# Altium schematic sheet Принципиальная схема.SchDoc: =title_line_1 + title_line_2
size 840 x 594 mm; SheetNumber: n
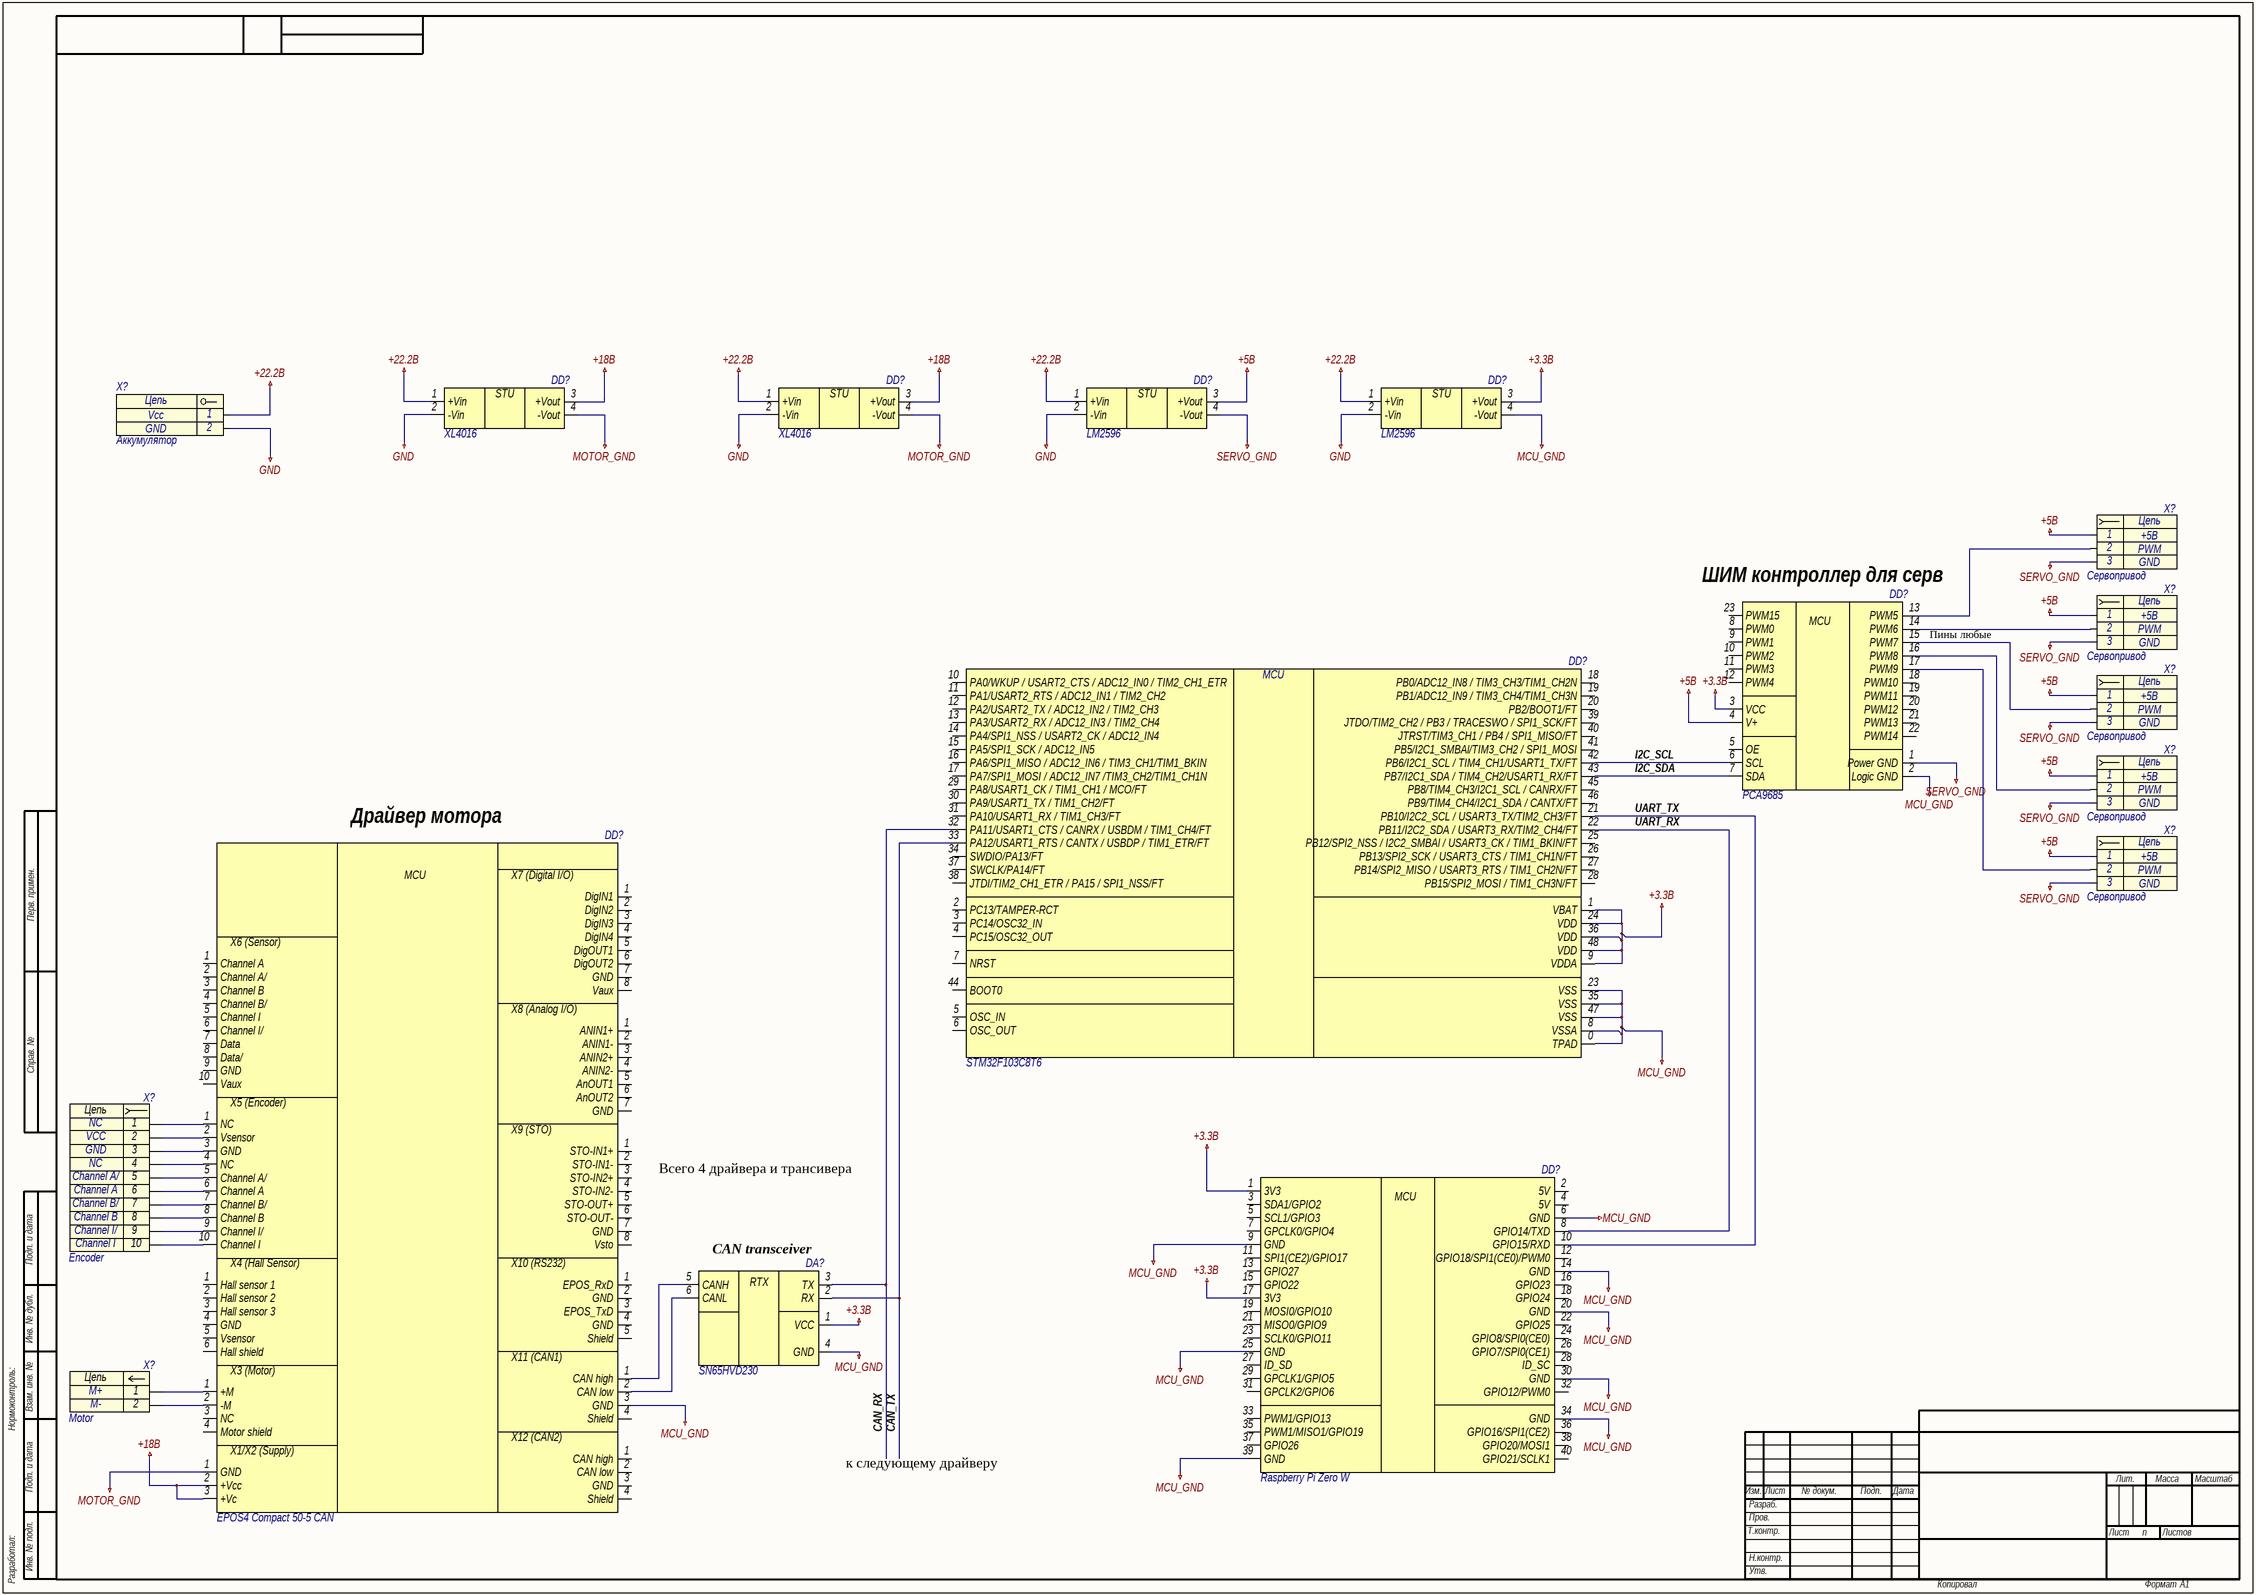
[diagram p0: Принципиальная схема.SchDoc]

## Parts
(Parts that share a designator on the sheet are numbered #1, #2 ... from top to bottom, then left to right.)
DA?  SN65HVD230
DD?#1  XL4016
DD?#2  XL4016
DD?#3  LM2596
DD?#4  LM2596
DD?#5  STM32F103C8T6  [ufqfpn-48_700x700x60p]
DD?#6  PCA9685
DD?#7  Raspberry Pi Zero W
DD?#8  EPOS4 Compact 50-5 CAN
X?#1  Аккумулятор  [terminal-2,54-2-tht-ra-850]
X?#2  Сервопривод  [click-mate-1,25-3-smd-v]
X?#3  Сервопривод  [click-mate-1,25-3-smd-v]
X?#4  Сервопривод  [click-mate-1,25-3-smd-v]
X?#5  Сервопривод  [click-mate-1,25-3-smd-v]
X?#6  Сервопривод  [click-mate-1,25-3-smd-v]
X?#7  Encoder
X?#8  Motor  [DS1029-2-MRW6XB]

## Nets
+3.3В: DA?.1(VCC) DD?#4.3(+Vout) DD?#5.1(VBAT) DD?#5.9(VDDA) DD?#5.24(VDD) DD?#5.36(VDD) DD?#5.48(VDD) DD?#6.3(VCC) DD?#7.1(3V3) DD?#7.17(3V3)
+5В: DD?#3.3(+Vout) DD?#6.4(V+) X?#2.1 X?#3.1 X?#4.1 X?#5.1 X?#6.1
+18В: DD?#1.3(+Vout) DD?#2.3(+Vout) DD?#8.2(+Vcc) DD?#8.3(+Vc)
+22.2В: DD?#1.1(+Vin) DD?#2.1(+Vin) DD?#3.1(+Vin) DD?#4.1(+Vin) X?#1.1
GND: DD?#1.2(-Vin) DD?#2.2(-Vin) DD?#3.2(-Vin) DD?#4.2(-Vin) X?#1.2
MCU_GND: DA?.4(GND) DD?#4.4(-Vout) DD?#5.0(TPAD) DD?#5.8(VSSA) DD?#5.23(VSS) DD?#5.35(VSS) DD?#5.47(VSS) DD?#6.2(Logic_GND) DD?#7.6(GND) DD?#7.9(GND) DD?#7.14(GND) DD?#7.20(GND) DD?#7.25(GND) DD?#7.30(GND) DD?#7.34(GND) DD?#7.39(GND) DD?#8.3(GND)
MOTOR_GND: DD?#1.4(-Vout) DD?#2.4(-Vout) DD?#8.1(GND)
SERVO_GND: DD?#3.4(-Vout) DD?#6.1(Power_GND) X?#2.3 X?#3.3 X?#4.3 X?#5.3 X?#6.3
NetDA?_2: DA?.2(RX) DD?#5.33(PA12/USART1_RTS_/_CANTX_/_USBDP_/_TIM1_ETR/FT)
NetDA?_3: DA?.3(TX) DD?#5.32(PA11/USART1_CTS_/_CANRX_/_USBDM_/_TIM1_CH4/FT)
NetDA?_5: DA?.5(CANH) DD?#8.1(CAN_high)
NetDA?_6: DA?.6(CANL) DD?#8.2(CAN_low)
NetDD?#5_21: DD?#5.21(PB10/I2C2_SCL_/_USART3_TX/TIM2_CH3/FT) DD?#7.10(GPIO15/RXD)
NetDD?#5_22: DD?#5.22(PB11/I2C2_SDA_/_USART3_RX/TIM2_CH4/FT) DD?#7.8(GPIO14/TXD)
NetDD?#5_42: DD?#5.42(PB6/I2C1_SCL_/_TIM4_CH1/USART1_TX/FT) DD?#6.6(SCL)
NetDD?#5_43: DD?#5.43(PB7/I2C1_SDA_/_TIM4_CH2/USART1_RX/FT) DD?#6.7(SDA)
NetDD?#6_13: DD?#6.13(PWM5) X?#2.2
NetDD?#6_14: DD?#6.14(PWM6) X?#3.2
NetDD?#6_15: DD?#6.15(PWM7) X?#4.2
NetDD?#6_16: DD?#6.16(PWM8) X?#5.2
NetDD?#6_17: DD?#6.17(PWM9) X?#6.2
NetDD?#8_1: DD?#8.1(+M) X?#8.1
NetDD?#8_1: DD?#8.1(NC) X?#7.1  [a separate net that carries the same name]
NetDD?#8_2: DD?#8.2(-M) X?#8.2
NetDD?#8_2: DD?#8.2(Vsensor) X?#7.2  [a separate net that carries the same name]
NetDD?#8_3: DD?#8.3(GND) X?#7.3
NetDD?#8_4: DD?#8.4(Shield) X?#7.4
NetDD?#8_5: DD?#8.5(Vsensor) X?#7.5
NetDD?#8_6: DD?#8.6(Hall_shield) X?#7.6
NetDD?#8_7: DD?#8.7(Channel_B/) X?#7.7
NetDD?#8_8: DD?#8.8(Channel_B) X?#7.8
NetDD?#8_9: DD?#8.9(Channel_I/) X?#7.9
NetDD?#8_10: DD?#8.10(Channel_I) X?#7.TP1

Not connected (* = marked no-connect by the designer): DD?#5 2(PC13/TAMPER-RCT) 3(PC14/OSC32_IN) 4(PC15/OSC32_OUT) 5(OSC_IN) 6(OSC_OUT) 7(NRST) 10(PA0/WKUP_/_USART2_CTS_/_ADC12_IN0_/_TIM2_CH1_ETR) 11(PA1/USART2_RTS_/_ADC12_IN1_/_TIM2_CH2) 12(PA2/USART2_TX_/_ADC12_IN2_/_TIM2_CH3) 13(PA3/USART2_RX_/_ADC12_IN3_/_TIM2_CH4) 14(PA4/SPI1_NSS_/_USART2_CK_/_ADC12_IN4) 15(PA5/SPI1_SCK_/_ADC12_IN5) 16(PA6/SPI1_MISO_/_ADC12_IN6_/_TIM3_CH1/TIM1_BKIN) 17(PA7/SPI1_MOSI_/_ADC12_IN7_/TIM3_CH2/TIM1_CH1N) 18(PB0/ADC12_IN8_/_TIM3_CH3/TIM1_CH2N) 19(PB1/ADC12_IN9_/_TIM3_CH4/TIM1_CH3N) 20(PB2/BOOT1/FT) 25(PB12/SPI2_NSS_/_I2C2_SMBAl_/_USART3_CK_/_TIM1_BKIN/FT) 26(PB13/SPI2_SCK_/_USART3_CTS_/_TIM1_CH1N/FT) 27(PB14/SPI2_MISO_/_USART3_RTS_/_TIM1_CH2N/FT) 28(PB15/SPI2_MOSI_/_TIM1_CH3N/FT) 29(PA8/USART1_CK_/_TIM1_CH1_/_MCO/FT) 30(PA9/USART1_TX_/_TIM1_CH2/FT) 31(PA10/USART1_RX_/_TIM1_CH3/FT) 34(SWDIO/PA13/FT) 37(SWCLK/PA14/FT) 38(JTDI/TIM2_CH1_ETR_/_PA15_/_SPI1_NSS/FT) 39(JTDO/TIM2_CH2_/_PB3_/_TRACESWO_/_SPI1_SCK/FT) 40(JTRST/TIM3_CH1_/_PB4_/_SPI1_MISO/FT) 41(PB5/I2C1_SMBAl/TIM3_CH2_/_SPI1_MOSI) 44(BOOT0) 45(PB8/TIM4_CH3/I2C1_SCL_/_CANRX/FT) 46(PB9/TIM4_CH4/I2C1_SDA_/_CANTX/FT); DD?#6 5(OE) 8(PWM0) 9(PWM1) 10(PWM2) 11(PWM3) 12(PWM4) 18(PWM10) 19(PWM11) 20(PWM12) 21(PWM13) 22(PWM14) 23(PWM15); DD?#7 2(5V) 3(SDA1/GPIO2) 4(5V) 5(SCL1/GPIO3) 7(GPCLK0/GPIO4) 11(SPI1(CE2)/GPIO17) 12(GPIO18/SPI1(CE0)/PWM0) 13(GPIO27) 15(GPIO22) 16(GPIO23) 18(GPIO24) 19(MOSI0/GPIO10) 21(MISO0/GPIO9) 22(GPIO25) 23(SCLK0/GPIO11) 24(GPIO8/SPI0(CE0)) 26(GPIO7/SPI0(CE1)) 27(ID_SD) 28(ID_SC) 29(GPCLK1/GPIO5) 31(GPCLK2/GPIO6) 32(GPIO12/PWM0) 33(PWM1/GPIO13) 35(PWM1/MISO1/GPIO19) 36(GPIO16/SPI1(CE2)) 37(GPIO26) 38(GPIO20/MOSI1) 40(GPIO21/SCLK1); X?#2 TP1 TP2; X?#3 TP1 TP2; X?#4 TP1 TP2; X?#5 TP1 TP2; X?#6 TP1 TP2

## Notes on the sheet
- (near DD?#6) ШИМ контроллер для серв
- (near DD?#6) Пины любые
- I2C_SCL
- I2C_SDA
- UART_TX
- Драйвер мотора
- UART_RX
- Всего 4 драйвера и трансивера
- (near DA?) CAN transceiver
- CAN_RX
- CAN_TX
- к следующему драйверу
- Перв. примен.
- Справ. №
- Подп. и дата
- Инв. № дубл.
- Нормоконтроль:
- Взам. инв. №
- Изм.
- Лист
- № докум.
- Подп.
- Дата
- Лит.
- Масса
- Масштаб
- Т.контр.
- Пров.
- Разраб.
- Листов
- Разработал:
- Инв. № подл.
- Н.контр.
- Утв.
- Копировал
- Формат
- А1
- (in symbol k0001) RTX
- (in symbol k0002) MCU
- (in symbol k0003) MCU; X7 (Digital I/O); X6 (Sensor); X8 (Analog I/O); X5 (Encoder); X9 (STO); X4 (Hall Sensor); X10 (RS232); X11 (CAN1); X3 (Motor); X12 (CAN2); X1/X2 (Supply)
- (in symbol k0004) STU
- (in symbol k0005) MCU
- (in symbol k0006) STU
- (in symbol k0007) Цепь; NC; VCC; GND; Channel A/; Channel A; Channel B/; Channel B; Channel I/; Channel I; 10
- (in symbol stm32f103cb) MCU
- (in symbol x2-k) Цепь
- (in symbol x3-f-2tp) Цепь
- (in symbol x0006) Цепь

## Library data of the parts
DA? = k0001: =Описание; ID: k0001; Описание: CAN приёмопередатчик; Наименование: SN65HVD230
DD?#1 DD?#2 = k0006: =Описание; ID: k0006; Описание: DC-DC преобразователь; Наименование: XL4016
DD?#3 DD?#4 = k0004: =Описание; ID: k0004; Описание: DC-DC преобразователь; Наименование: LM2596
DD?#5 = stm32f103cb: pmsz-plm:union[39e9d687]:4450/IO.186737; Версия SchLib: pmsz-plm:union[39e9d687]:4450/IO.204451.1; Учитывать как: pmsz-plm:union[39e9d687]:4450/IO.186725; Напряжение питания среднее: 3,3 В; Входные цепи: напряжение высокого уровня: 2 В; Входные цепи: напряжение низкого уровня: 0,8 В; Разрядность: 32; Температура окружающей среды (корпуса), мин.: - 40 °C; Группа КРР: 65; Производитель: ф. STMicroelectronics, Швейцария; Примечание: имп.изд.; Корпус: UFQFPN-48; Тип: Микросхема; Описание в документацию: 32-разрадный микроконтроллер; Дата изменения документации: August 2015 Rev 17; Мощность рассеивания: 624 мВт; Флеш-память: 128 кБ; Входные цепи: частота: 72 МГц; Температура окружающей среды (корпуса), макс.: + 85 °C; CAN: 1; I2C: 2; UART/USART: 3; Количество входов/выходов: 26; ОЗУ: 12 кБ; Напряжение питания, макс.: 3,6 В; Другие интерфейсы: IrDA, LIN; Периферия: DMA, Motor Control PWM, PDR, POR, PVD, PWM, Температурный сенсор; Тип памяти программ: Флеш-память; Ядро: ARM Cortex-M3; Подтип: Микроконтроллер; Name: STM32F103C8T6; Компонент библиотеки ECAD: pmsz-plm:union[39e9d687]:4450/IO.186737; Серия: STM32F1; Обозначение документа на поставку: ф. STMicroelectronics, Швейцария; HelpURL: https://st.com/resource/en/datasheet/stm32f103tb.pdf; SPI: 2; USB: 1; Напряжение питания, мин.: 2 В
DD?#6 = k0005: =Описание; ID: k0005; Описание: ШИМ-контроллер; Наименование: PCA9685
DD?#7 = k0002: =Описание; ID: k0002; Описание: Одноплатный компьютер; Наименование: Raspberry Pi Zero W; HelpURL: http://wiki.amperka.ru/products:raspberry-pi-zero-w#%D1%80%D0%B5%D1%81%D1%83%D1%80%D1%81%D1%8B
DD?#8 = k0003: =Описание; ID: k0003; Описание: Драйвер; Наименование: EPOS4 Compact 50-5 CAN
X?#1 = x2-k: pmsz-plm:union[39e9d687]:4450/IO.395752; Contact_1: Vcc; Contact_2: GND; Версия SchLib: pmsz-plm:union[39e9d687]:4450/IO.396483.1; Учитывать как: pmsz-plm:union[39e9d687]:4450/IO.395766; Макс. величина тока: 8 А; Макс. величина напряжения: 130 В; Температура окружающей среды (корпуса), мин.: - 40 °C; Серия: DG308-2.54; Группа КРР: 75; Производитель: ф. DEGSON, Китай; Примечание: имп.изд.; Тип: Соединитель; Монтаж хвостовиков контактов вилки (розетки): пайка; Кол-во соединений: 2; Описание в документацию: Соединитель  2 конт. клемма прямая Клемма; Шаг: 2,54 мм; Форма контакта: прямая; Подтип: клемма; Температура окружающей среды (корпуса), макс.: + 105 °C; Монтаж: THT; Кол-во рядов: 1; System: Connector; Name: Аккумулятор; Компонент библиотеки ECAD: pmsz-plm:union[39e9d687]:4450/IO.395752; Обозначение документа на поставку: ф. DEGSON, Китай; HelpURL: http://www.degson.com/ru/pro_detail/id/1027; Семейство: Клемма
X?#2-X?#6 = x3-f-2tp: pmsz-plm:union[39e9d687]:4450/IO.383390; Contact_1: +5В; Contact_2: PWM; Contact_3: GND; Версия SchLib: pmsz-plm:union[39e9d687]:4450/IO.142986.7; Учитывать как: pmsz-plm:union[39e9d687]:4450/IO.383350; Макс. величина тока: 1 А; Макс. величина напряжения: 50 В; Температура окружающей среды (корпуса), мин.: - 40 °C; Серия: 502382; Группа КРР: 75; Производитель: ф. Molex, США; Примечание: имп.изд.; Тип: Соединитель; Монтаж хвостовиков контактов вилки (розетки): пайка; Кол-во соединений: 3; Описание в документацию: Соединитель  3 конт. розетка прямая Click-Mate; Шаг: 1,25 мм; Форма контакта: прямая; Подтип: розетка; Температура окружающей среды (корпуса), макс.: + 105 °C; Семейство: Click-Mate; Монтаж: SMD; Кол-во рядов: 1; System: Connector; Ответная часть: 502380-0300; Name: Сервопривод; Компонент библиотеки ECAD: pmsz-plm:union[39e9d687]:4450/IO.383390; Обозначение документа на поставку: ф. Molex, США; HelpURL: https://www.molex.com/pdm_docs/sd/5023820270_sd.pdf
X?#7 = k0007: =Описание; ID: k0007; Описание: Энкодер мотора; Contact_1: Contact_1; Contact_2: Contact_2; Contact_3: Contact_3; Contact_4: Contact_4; Contact_5: Contact_5; Contact_6: Contact_6; Contact_7: Contact_7; Contact_8: Contact_8; Contact_9: Contact_9
X?#8 = x0006: =Описание; Contact_1: M+; Contact_2: M-; ID: x0006; Фамилия: Ларионов; Описание: CWF 2 pin Type B 2,5 мм вилка угловой; Производитель: Connfly Electronic Co. LTD.; Наименование: DS1029-2-MRW6XB; HelpURL: http://www.connfly.com/productshow.aspx?id=352